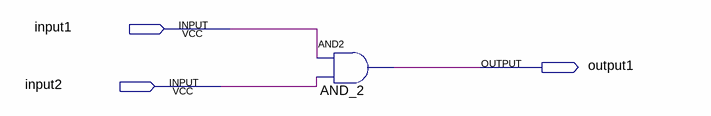
[diagram p0: schematic sheet]
// Quartus schematic Pratica1.bdf as structural Verilog: 1 symbols, 3 pins
module Pratica1 (
  input  input1,
  input  input2,
  output output1
);

  and AND_2 (output1, input1, input2);
endmodule
